# Altium schematic sheet currentRead.SchDoc
size A4
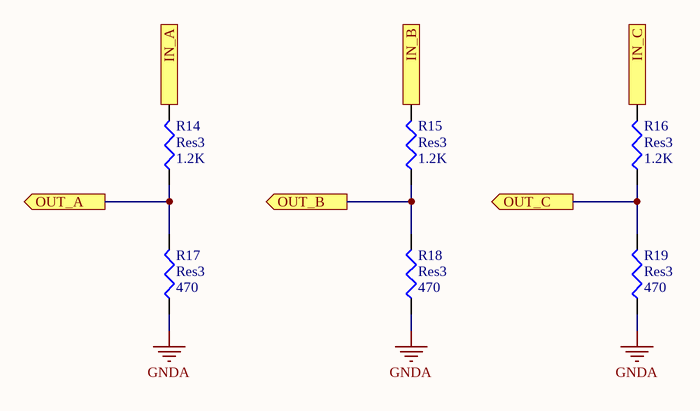
[diagram p0: currentRead.SchDoc]

## Parts
R14  Res3  value 1.2K  [12Z-2010]
R15  Res3  value 1.2K  [12Z-2010]
R16  Res3  value 1.2K  [12Z-2010]
R17  Res3  value 470  [12Z-2010]
R18  Res3  value 470  [12Z-2010]
R19  Res3  value 470  [12Z-2010]

## Ports
IN_A (in), IN_B (in), IN_C (in), OUT_A (out), OUT_B (out), OUT_C (out)

## Nets
GNDA: R17.1 R18.1 R19.1
IN_A: R14.2 ; port IN_A
IN_B: R15.2 ; port IN_B
IN_C: R16.2 ; port IN_C
OUT_A: R14.1 R17.2 ; port OUT_A
OUT_B: R15.1 R18.2 ; port OUT_B
OUT_C: R16.1 R19.2 ; port OUT_C

## Library data of the parts
R14-R19 = Res3: Resistor; Published: 8-Jun-2000; LatestRevisionDate: 29-May-2009; LatestRevisionNote: IPC-7351 Footprint Added.; PackageReference: J1-0603; Publisher: Altium Limited; PackageDescription: Chip Resistor